# Altium project Avr_IDC6_IDC10.PrjPcb
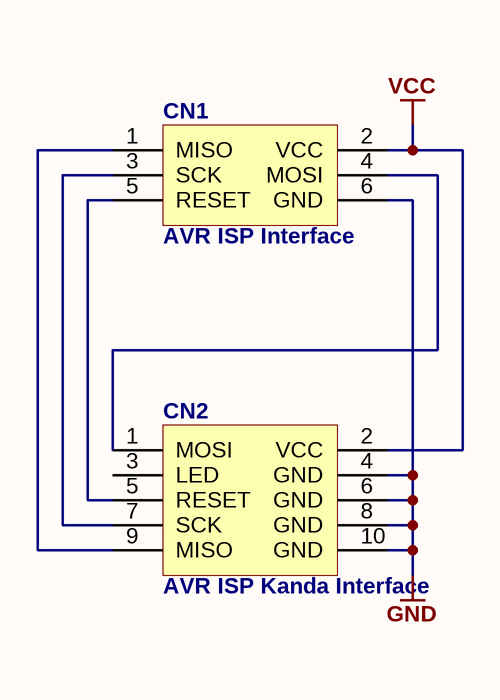
[diagram p0: sch.SchDoc]
1 sheet, 2 parts. Net scope: global (net labels, ports and power ports of the same name join across sheets).
Board file: pcb.PcbDoc

## Sheet sch.SchDoc: AVR IDC6 <-> IDC10 Converter
size A4; Date: 04/03/2013; CheckedBy: X; DrawnBy: Pawel Poryzala; Revision: 1.0.0; SheetNumber: 1; SheetTotal: 1; Projectnumber: OWN-000; Size: A4; Projectname: X

### Parts
CN1  AVR ISP Interface  [IDC6]
CN2  AVR ISP Kanda Interface  [GP_5x2H_F]

### Nets
GND: CN1.6(GND) CN2.4(GND) CN2.6(GND) CN2.8(GND) CN2.10(GND)
VCC: CN1.2(VCC) CN2.2(VCC)
NetCN1_1: CN1.1(MISO) CN2.9(MISO)
NetCN1_3: CN1.3(SCK) CN2.7(SCK)
NetCN1_4: CN1.4(MOSI) CN2.1(MOSI)
NetCN1_5: CN1.5(RESET) CN2.5(RESET)

Not connected (* = marked no-connect by the designer): CN2 3(LED)

### Notes on the sheet
- PROJECT NAME:
- PROJECT NO.:
- DATE:
- TITLE:
- SHEET
- of
- DRAWN BY:
- REVISION:
- FILENAME:
- A4

### Library data of the parts
CN1 = AVR ISP Interface: ISP Programming Header for AVR MCU's
CN2 = AVR ISP Kanda Interface: Kanda ISP Programming Header for AVR MCU's